# Altium schematic sheet CM4_GPIO.SchDoc
size A3; DocumentNumber: 2; SheetNumber: 2
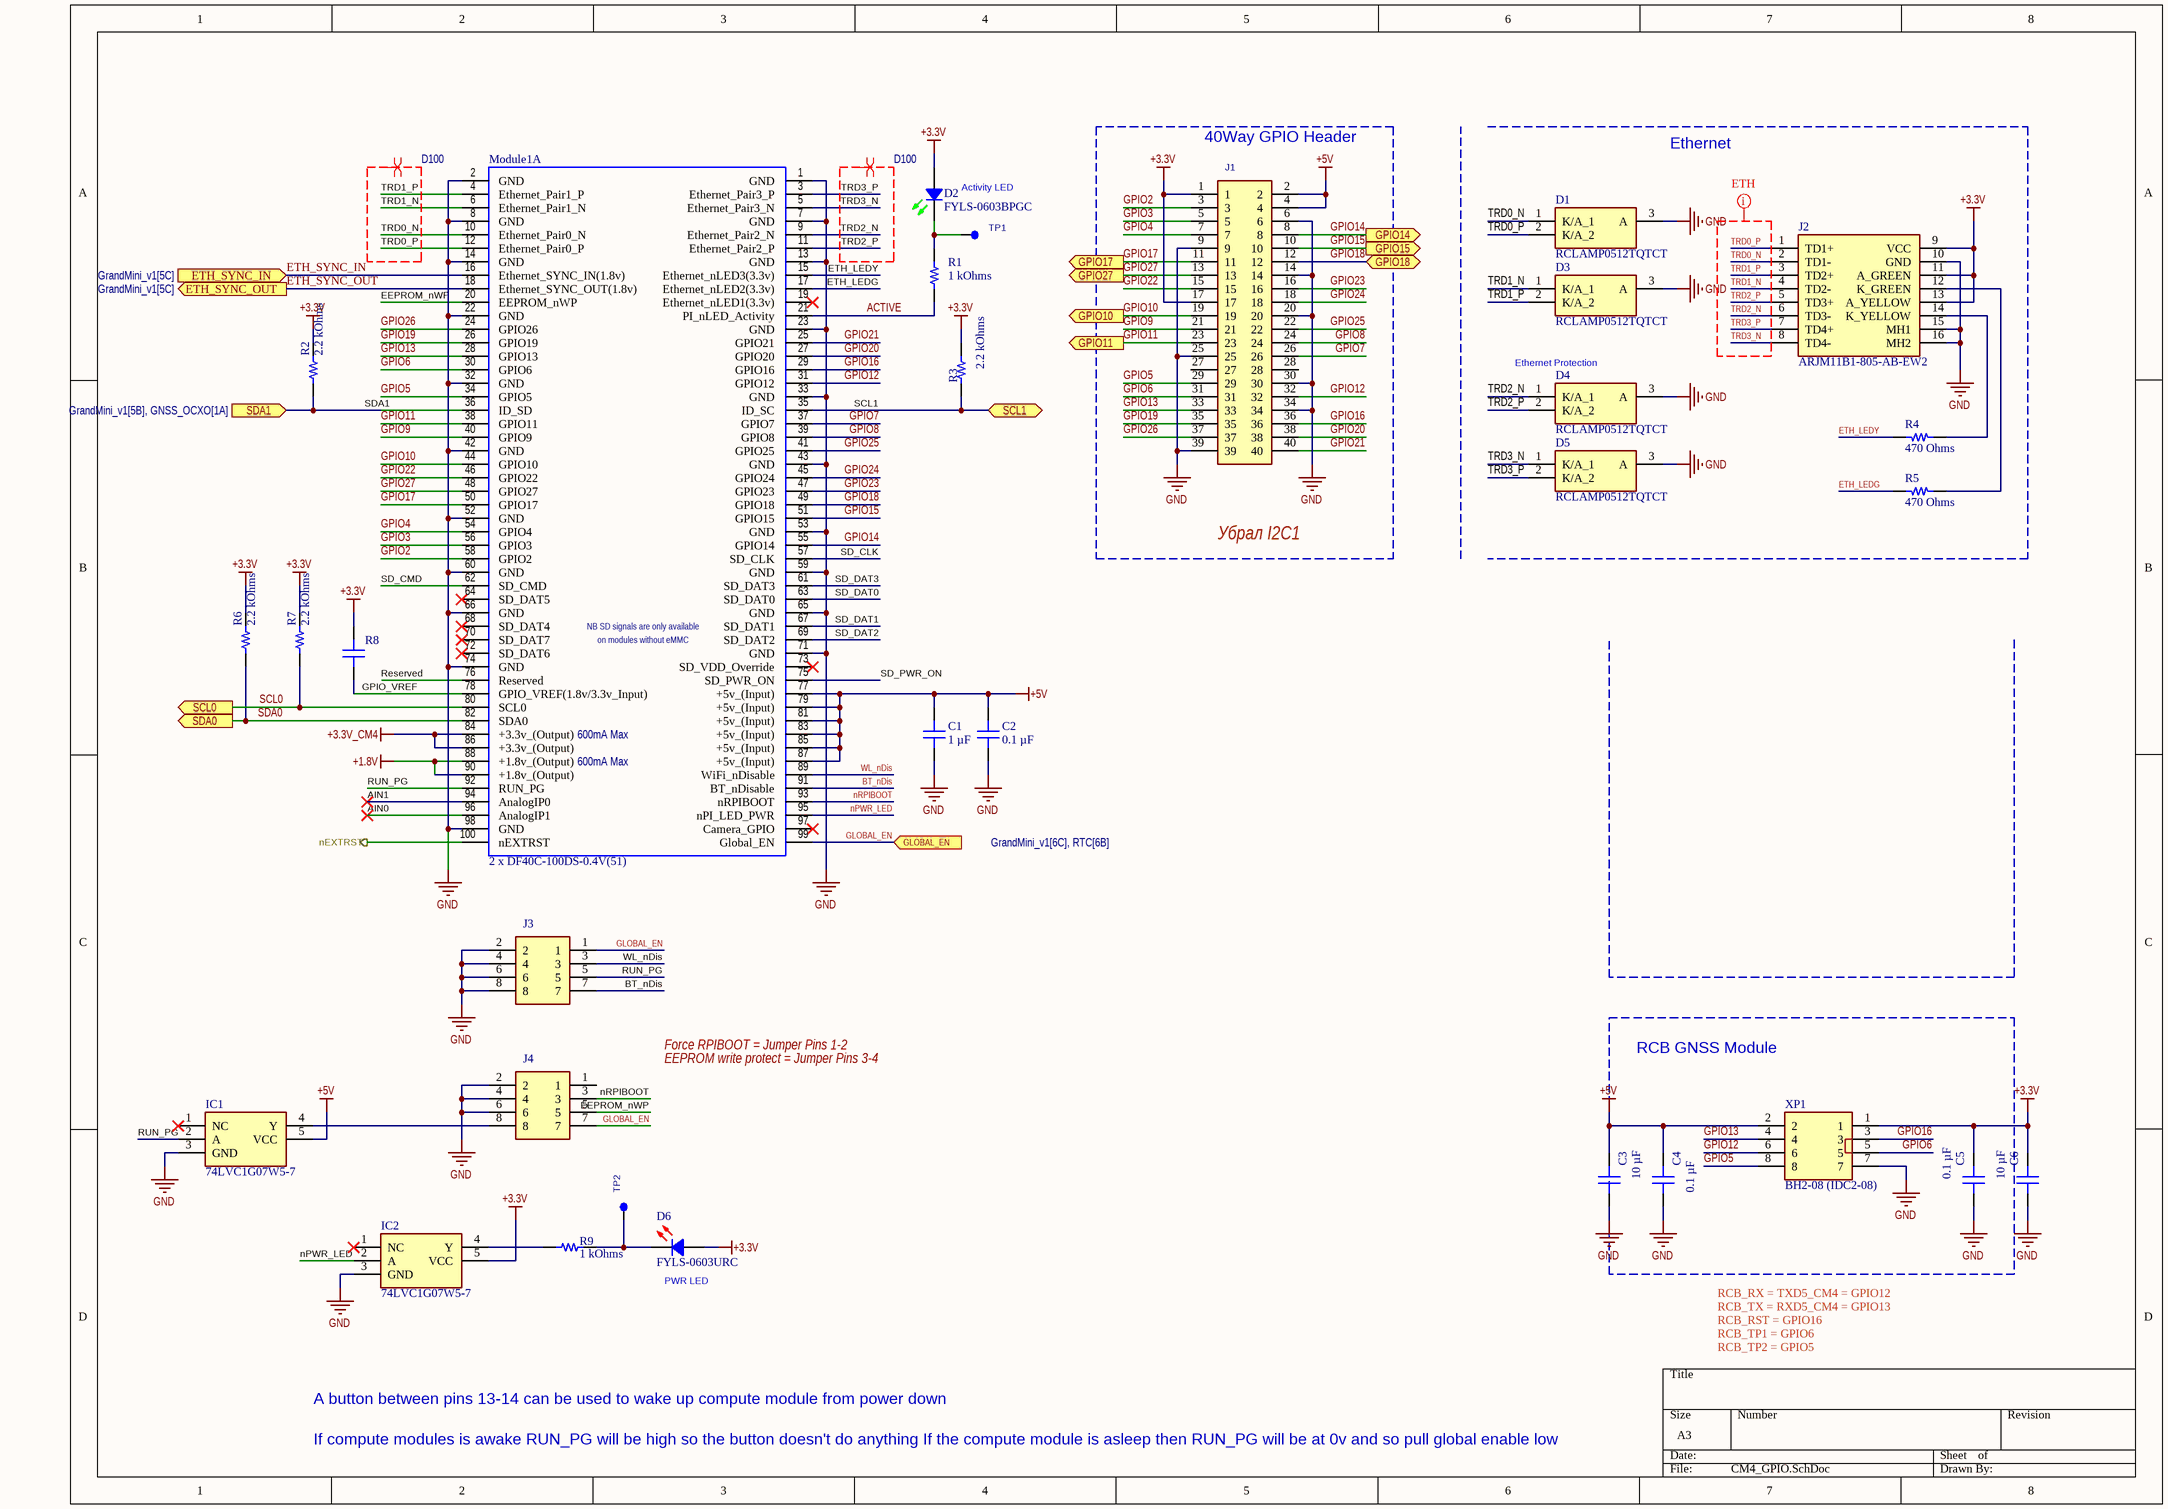
[diagram p0: CM4_GPIO.SchDoc]

## Parts
C1  1 µF  [CAP 0603_1608]
C2  0.1 µF  [CAP 0603_1608]
C3  10 µF  [CAP 0805_2012]
C4  0.1 µF  [CAP 0603_1608]
C5  0.1 µF  [CAP 0603_1608]
C6  10 µF  [CAP 0805_2012]
D1  RCLAMP0512TQTCT  [RCLAMP0512TQTCT]
D2  FYLS-0603BPGC  [LEDC1608X55N_GREEN]
D3  RCLAMP0512TQTCT  [RCLAMP0512TQTCT]
D4  RCLAMP0512TQTCT  [RCLAMP0512TQTCT]
D5  RCLAMP0512TQTCT  [RCLAMP0512TQTCT]
D6  FYLS-0603URC  [LEDC1608X55N_RED]
IC1  74LVC1G07W5-7  [SOT95P285X140-5N]
IC2  74LVC1G07W5-7  [SOT95P285X140-5N]
J1  PBD-40  [PBD-40]  (value not drawn)
J2  ARJM11B1-805-AB-EW2  [ARJM11B1805ABEW2]
J3  PLD-8  [PLD-8]  (value not drawn)
J4  PLD-8  [PLD-8]  (value not drawn)
Module1  2 x DF40C-100DS-0.4V(51)  [RPI_CM4_STACKED]  (part A of 2)
R1  1 kOhms  [YAGEO RES 0603_1608]
R2  2.2 kOhms  [YAGEO RES 0402_1005]
R3  2.2 kOhms  [YAGEO RES 0402_1005]
R4  470 Ohms  [YAGEO RES 0402_1005]
R5  470 Ohms  [YAGEO RES 0402_1005]
R6  2.2 kOhms  [YAGEO RES 0402_1005]
R7  2.2 kOhms  [YAGEO RES 0402_1005]
R8  10 µF  [CAP 0805_2012]  (value not drawn)
R9  1 kOhms  [YAGEO RES 0603_1608]
TP1  PAD_TEST  [PAD_TEST]  (value not drawn)  (no BOM)
TP2  PAD_TEST  [PAD_TEST]  (value not drawn)  (no BOM)
XP1  BH2-08 (IDC2-08)  [BH2-08]

## Blocks framed on the sheet
Убрал I2C1: J1
RCB GNSS Module: C3-C5 XP1

## Ports
ETH_SYNC_IN (in, see GrandMini_v1[5C]), ETH_SYNC_OUT (out, see GrandMini_v1[5C]), GLOBAL_EN (in, see GrandMini_v1[6C], RTC[6B]), GPIO10 (out, see GrandMini_v1[5B], GNSS_OCXO[3A]), GPIO11 (out, see GrandMini_v1[5B], GNSS_OCXO[3A]), GPIO14 (out, see GrandMini_v1[5B], GNSS_OCXO[3A]), GPIO15 (out, see GrandMini_v1[5B], GNSS_OCXO[3A]), GPIO17 (out, see GrandMini_v1[5B], GNSS_OCXO[1B]), GPIO18 (bidir, see GrandMini_v1[5B], GNSS_OCXO[3A]), GPIO27 (out, see GrandMini_v1[5B], GNSS_OCXO[1B]), nEXTRST (out, see GrandMini_v1[6C], USB2-HUB[1B]), SCL0 (out, see GrandMini_v1[6B], RTC[3A]), SCL1 (bidir, see GrandMini_v1[5B], GNSS_OCXO[1A]), SDA0 (out, see GrandMini_v1[6B], RTC[3B]), SDA1 (in, see GrandMini_v1[5B], GNSS_OCXO[1A])

## Nets
+1.8V: Module1.88(+1.8v_(Output)) Module1.90(+1.8v_(Output))
+3.3V: C5.2 C6.2 D2.2(C) D6.2(C) IC2.5(VCC) J1.1 J1.17 J2.9(VCC) J2.11(A_GREEN) J2.13(A_YELLOW) R2.2 R3.2 R6.2 R7.2 R8.2 XP1.1
+3.3V_CM4: Module1.84(+3.3v_(Output)) Module1.86(+3.3v_(Output))
+5V: C1.2 C2.2 C3.2 C4.2 IC1.5(VCC) J1.2 J1.4 Module1.77(+5v_(Input)) Module1.79(+5v_(Input)) Module1.81(+5v_(Input)) Module1.83(+5v_(Input)) Module1.85(+5v_(Input)) Module1.87(+5v_(Input)) XP1.2
GND: C1.1 C2.1 C3.1 C4.1 C5.1 C6.1 D1.3(A) D3.3(A) D4.3(A) D5.3(A) IC1.3(GND) IC2.3(GND) J1.6 J1.9 J1.14 J1.20 J1.25 J1.30 J1.34 J1.39 J2.10(GND) J2.15(MH1) J2.16(MH2) J3.2 J3.4 J3.6 J3.8 J4.2 J4.4 J4.6 Module1.1(GND) Module1.2(GND) Module1.7(GND) Module1.8(GND) Module1.13(GND) Module1.14(GND) Module1.22(GND) Module1.23(GND) Module1.32(GND) Module1.33(GND) Module1.42(GND) Module1.43(GND) Module1.52(GND) Module1.53(GND) Module1.59(GND) Module1.60(GND) Module1.65(GND) Module1.66(GND) Module1.71(GND) Module1.74(GND) Module1.98(GND) XP1.7
ACTIVE: Module1.21(PI_nLED_Activity) R1.1
AIN0: Module1.96(AnalogIP1)
AIN1: Module1.94(AnalogIP0)
BT_nDis: J3.7 Module1.91(BT_nDisable)
EEPROM_nWP: J4.5 Module1.20(EEPROM_nWP)
ETH_LEDG: Module1.17(Ethernet_nLED2(3.3v)) R5.2
ETH_LEDY: Module1.15(Ethernet_nLED3(3.3v)) R4.2
ETH_SYNC_IN: Module1.16(Ethernet_SYNC_IN(1.8v)) ; port ETH_SYNC_IN
ETH_SYNC_OUT: Module1.18(Ethernet_SYNC_OUT(1.8v)) ; port ETH_SYNC_OUT
GLOBAL_EN: J3.1 J4.7 Module1.99(Global_EN) ; port GLOBAL_EN
GPIO2: J1.3 Module1.58(GPIO2)
GPIO3: J1.5 Module1.56(GPIO3)
GPIO4: J1.7 Module1.54(GPIO4)
GPIO5: J1.29 Module1.34(GPIO5) XP1.8
GPIO6: J1.31 Module1.30(GPIO6) XP1.5
GPIO7: J1.26 Module1.37(GPIO7)
GPIO8: J1.24 Module1.39(GPIO8)
GPIO9: J1.21 Module1.40(GPIO9)
GPIO10: J1.19 Module1.44(GPIO10) ; port GPIO10
GPIO11: J1.23 Module1.38(GPIO11) ; port GPIO11
GPIO12: J1.32 Module1.31(GPIO12) XP1.6
GPIO13: J1.33 Module1.28(GPIO13) XP1.4
GPIO14: J1.8 Module1.55(GPIO14) ; port GPIO14
GPIO15: J1.10 Module1.51(GPIO15) ; port GPIO15
GPIO16: J1.36 Module1.29(GPIO16) XP1.3
GPIO17: J1.11 Module1.50(GPIO17) ; port GPIO17
GPIO18: J1.12 Module1.49(GPIO18) ; port GPIO18
GPIO19: J1.35 Module1.26(GPIO19)
GPIO20: J1.38 Module1.27(GPIO20)
GPIO21: J1.40 Module1.25(GPIO21)
GPIO22: J1.15 Module1.46(GPIO22)
GPIO23: J1.16 Module1.47(GPIO23)
GPIO24: J1.18 Module1.45(GPIO24)
GPIO25: J1.22 Module1.41(GPIO25)
GPIO26: J1.37 Module1.24(GPIO26)
GPIO27: J1.13 Module1.48(GPIO27) ; port GPIO27
GPIO_VREF: Module1.78(GPIO_VREF(1.8v/3.3v_Input)) R8.1
nEXTRST: Module1.100(nEXTRST) ; port nEXTRST
nPWR_LED: IC2.2(A) Module1.95(nPI_LED_PWR)
nRPIBOOT: J4.3 Module1.93(nRPIBOOT)
RUN_PG: IC1.2(A) J3.5 Module1.92(RUN_PG)
SCL0: Module1.80(SCL0) R7.1 ; port SCL0
SCL1: Module1.35(ID_SC) R3.1 ; port SCL1
SD_CLK: Module1.57(SD_CLK)
SD_CMD: Module1.62(SD_CMD)
SD_DAT0: Module1.63(SD_DAT0)
SD_DAT1: Module1.67(SD_DAT1)
SD_DAT2: Module1.69(SD_DAT2)
SD_DAT3: Module1.61(SD_DAT3)
SD_PWR_ON: Module1.75(SD_PWR_ON)
SDA0: Module1.82(SDA0) R6.1 ; port SDA0
SDA1: Module1.36(ID_SD) R2.1 ; port SDA1
TRD0_N: D1.1(K/A_1) J2.2(TD1-) Module1.10(Ethernet_Pair0_N)
TRD0_P: D1.2(K/A_2) J2.1(TD1+) Module1.12(Ethernet_Pair0_P)
TRD1_N: D3.1(K/A_1) J2.4(TD2-) Module1.6(Ethernet_Pair1_N)
TRD1_P: D3.2(K/A_2) J2.3(TD2+) Module1.4(Ethernet_Pair1_P)
TRD2_N: D4.1(K/A_1) J2.6(TD3-) Module1.9(Ethernet_Pair2_N)
TRD2_P: D4.2(K/A_2) J2.5(TD3+) Module1.11(Ethernet_Pair2_P)
TRD3_N: D5.1(K/A_1) J2.8(TD4-) Module1.5(Ethernet_Pair3_N)
TRD3_P: D5.2(K/A_2) J2.7(TD4+) Module1.3(Ethernet_Pair3_P)
WL_nDis: J3.3 Module1.89(WiFi_nDisable)
NetD2_1: D2.1(A) R1.2 TP1.1
NetD6_1: D6.1(A) R9.2 TP2.1
NetIC1_4: IC1.4(Y) J4.8
NetIC2_4: IC2.4(Y) R9.1
NetJ2_12: J2.12(K_GREEN) R5.1
NetJ2_14: J2.14(K_YELLOW) R4.1

Not connected (* = marked no-connect by the designer): IC1 1(NC)*; IC2 1(NC)*; J1 27 28; J4 1; Module1 19(Ethernet_nLED1(3.3v))* 64(SD_DAT5)* 68(SD_DAT4)* 70(SD_DAT7)* 72(SD_DAT6)* 73(SD_VDD_Override)* 76(Reserved) 97(Camera_GPIO)*

## Layout directives
differential pair; differential pair class D100: TRD0_N, TRD0_P, TRD1_N, TRD1_P, TRD2_N, TRD2_P, TRD3_N, TRD3_P
net class ETH: TRD0_N, TRD0_P, TRD1_N, TRD1_P, TRD2_N, TRD2_P, TRD3_N, TRD3_P

## Notes on the sheet
- (near J1) 40Way GPIO Header
- Ethernet
- Activity LED
- (near D4) Ethernet
  Protection
- Force RPIBOOT = Jumper Pins 1-2
- EEPROM write protect = Jumper Pins 3-4
- (near D6) PWR LED
- RCB_TX = RXD5_CM4 = GPIO13
- RCB_RX = TXD5_CM4 = GPIO12
- RCB_RST = GPIO16
- RCB_TP1 = GPIO6
- RCB_TP2 = GPIO5
- A button between pins 13-14 can be used to wake up compute module from power down
- If compute modules is awake RUN_PG will be high so the button doesn't do anything
  If the compute module is asleep then RUN_PG will be at 0v and so pull global enable low
- Labels drawn without touching a wire or pin: Reserved
- 1
- 2
- 3
- 4
- 5
- 6
- A
- B
- C
- www.raspberrypi.com <http://www.raspberrypi.com>
- D
- Title: Compute Module 4 IO Board - GPIO - Ethernet
- File: CM4_GPIO.kicad_sch
- Sheet: /
- © 2020-2022 Raspberry Pi Ltd (formerly Raspberry Pi (Trading) Ltd.)
- KiCad E.D.A.  kicad (5.1.4)-1
- Size: A4
- Date:
- Rev: 1
- Id: 1/1
- (in symbol RPi_CM4_1, part A) NB SD signals are only available; on modules without eMMC; 600mA Max

## Library data of the parts
C1 = CC0603KRX7R9BB105: CAP CER 1UF 50V X7R 0603; manufacturer: Yageo; Tolerance: ±10%; Part Number: CC0603KRX7R9BB105; Value: 1 µF; Applications: General Purpose; Capacitance: 1 µF; componentlink1description: Datasheet; componentlink1url: https://www.yageo.com/upload/media/product/productsearch/datasheet/mlcc/UPY-GPHC_X7R_6.3V-to-50V_20.pdf; componentlink2description: DigiKey Link; componentlink2url: https://www.digikey.com/en/products/detail/yageo/CC0603KRX7R9BB105/5883796; Device Package: 0603 (1608 Metric); lastupdated: 09.02.2024 20:09:49; Lifecycle Status: Active; Minimum Order: 1; Mounting Type: Surface Mount, MLCC; Operating Temperature: -55°C ~ 125°C; Package / Case: 0603 (1608 Metric); packaging: TapeAndReel; partid: 45844; Part Status: Active; price: 0.09; series: CC; Size / Dimension: 0.063" L x 0.031" W (1.60mm x 0.80mm); Supplier 1: DigiKey; Supplier Part Number 1: 311-2082-1-ND; Temperature Coefficient: X7R; Thickness (Max): 0.035" (0.90mm); Voltage - Rated: 50V
C2 C4 C5 = CC0603KRX7R9BB104: CAP CER 0.1UF 50V X7R 0603; manufacturer: Yageo; Tolerance: ±10%; Part Number: CC0603KRX7R9BB104; Value: 0.1 µF; Applications: General Purpose; Capacitance: 0.1 µF; componentlink1description: Datasheet; componentlink1url: https://www.yageo.com/upload/media/product/productsearch/datasheet/mlcc/UPY-GPHC_X7R_6.3V-to-50V_18.pdf; componentlink2description: DigiKey Link; componentlink2url: https://www.digikey.com/en/products/detail/yageo/CC0603KRX7R9BB104/2103082; Device Package: 0603 (1608 Metric); lastupdated: 09.02.2024 20:10:21; Lifecycle Status: Active; Minimum Order: 1; Mounting Type: Surface Mount, MLCC; Operating Temperature: -55°C ~ 125°C; Package / Case: 0603 (1608 Metric); packaging: TapeAndReel; partid: 9506; Part Status: Active; price: 0.01; series: CC; Size / Dimension: 0.063" L x 0.031" W (1.60mm x 0.80mm); Supplier 1: DigiKey; Supplier Part Number 1: 311-1344-1-ND; Temperature Coefficient: X7R; Thickness (Max): 0.035" (0.90mm); Voltage - Rated: 50V
C3 C6 R8 = CC0805KKX5R8BB106: CAP CER 10UF 25V X5R 0805; manufacturer: Yageo; Tolerance: ±10%; Value: 10 µF; Part Number: CC0805KKX5R8BB106; Applications: General Purpose; Capacitance: 10 µF; componentlink1description: Datasheet; componentlink1url: https://www.yageo.com/upload/media/product/productsearch/datasheet/mlcc/UPY-GPHC_X5R_4V-to-50V_25.pdf; componentlink2description: DigiKey Link; componentlink2url: https://www.digikey.com/en/products/detail/yageo/CC0805KKX5R8BB106/5195275; Device Package: 0805 (2012 Metric); lastupdated: 09.02.2024 20:15:28; Lifecycle Status: Active; Minimum Order: 1; Mounting Type: Surface Mount, MLCC; Operating Temperature: -55°C ~ 85°C; Package / Case: 0805 (2012 Metric); packaging: TapeAndReel; partid: 16151; Part Status: Active; price: 0.06; series: CC; Size / Dimension: 0.079" L x 0.049" W (2.00mm x 1.25mm); Supplier 1: DigiKey; Supplier Part Number 1: 311-1869-1-ND; Temperature Coefficient: X5R; Thickness (Max): 0.057" (1.45mm); Voltage - Rated: 25V
D1 D3-D5 = RCLAMP0512TQTCT: Diode; Manufacturer_Name: SEMTECH; Datasheet Link: https://media.digikey.com/pdf/Data%20Sheets/Semtech%20PDFs/RCLAMP0512TQ_Rev6_12-17-15.pdf; Height: 0.45mm; Manufacturer_Part_Number: RCLAMP0512TQTCT; Mouser Part Number: 947-RCLAMP0512TQTCT; Mouser Price/Stock: https://www.mouser.co.uk/ProductDetail/Semtech/RCLAMP0512TQTCT?qs=rBWM4%252BvDhIfq7vcNOg1BvQ%3D%3D; Arrow Part Number: RCLAMP0512TQTCT; Arrow Price/Stock: https://www.arrow.com/en/products/rclamp0512tqtct/semtech?utm_currency=USD&region=europe
D2 = FYLS-0603BPGC: LED, 0603, GREEN; Manufacturer_Name: FORYARD; Datasheet Link: https://v4.cecdn.yun300.cn/100001_2003185297/7%20FYLS-0603BXXXC-D.pdf; Height: 0.6mm; Manufacturer_Part_Number: FYLS-0603BPGC
D6 = FYLS-0603URC: LED, 0603, RED; Manufacturer_Name: FORYARD; Datasheet Link: https://v4.cecdn.yun300.cn/100001_2003185297/7%20FYLS-0603BXXXC-D.pdf; Height: 0.6mm; Manufacturer_Part_Number: FYLS-0603URC
IC1 IC2 = 74LVC1G07W5-7: Integrated Circuit; Manufacturer_Name: Diodes Incorporated; Datasheet Link: https://www.diodes.com//assets/Datasheets/74LVC1G07.pdf; Height: 1.4mm; Manufacturer_Part_Number: 74LVC1G07W5-7; Mouser Part Number: 621-74LVC1G07W5-7; Mouser Price/Stock: https://www.mouser.co.uk/ProductDetail/Diodes-Incorporated/74LVC1G07W5-7?qs=abZ1nkZpTuMhe1bWQEjvtw%3D%3D; Arrow Part Number: 74LVC1G07W5-7; Arrow Price/Stock: https://www.arrow.com/en/products/74lvc1g07w5-7/diodes-incorporated?utm_currency=USD&region=nac
J1 = PBD-40: Connector; Manufacturer: Connfly; Part Number1: DS-1023-2x20; System: Connector; Part Number: PBD-40
J2 = ARJM11B1-805-AB-EW2: Connector; Manufacturer_Name: ABRACON; Datasheet Link: https://abracon.com/Magnetics/ARJM11.pdf; Height: 13.75mm; Manufacturer_Part_Number: ARJM11B1-805-AB-EW2; Mouser Part Number: 815-RJM11B1805ABEW2; Mouser Price/Stock: https://www.mouser.co.uk/ProductDetail/ABRACON/ARJM11B1-805-AB-EW2?qs=YCa%2FAAYMW02bp%252BSCNzjdNA%3D%3D; Arrow Part Number: ARJM11B1-805-AB-EW2; Arrow Price/Stock: https://www.arrow.com/en/products/arjm11b1-805-ab-ew2/abracon?region=nac
J3 J4 = PLD-8_1: Connector; Manufacturer_Name: JST (JAPAN SOLDERLESS TERMINALS); Manufacturer_Part_Number: S4B-PH-SM4-TB(LF)(SN); Datasheet Link: http://uk.rs-online.com/web/p/products/6881366; Arrow Part Number: S4B-PH-SM4-TB(LF)(SN); Arrow Price/Stock: https://www.arrow.com/en/products/s4b-ph-sm4-tb-lf-sn/jst-manufacturing; System: Connector
Module1 = RPi_CM4_1: Rapsberry PI Compute Module 4 +
R1 R9 = RC0603FR-071KL: RES 1K OHM 1% 1/10W 0603; Manufacturer: Yageo; Power (Watts): 0.1W, 1/10W; Temperature Coefficient: ±100ppm/°C; Value: 1 kOhms; Part Number: RC0603FR-071KL; ComponentLink1Description: Datasheet; ComponentLink1URL: https://www.yageo.com/upload/media/product/productsearch/datasheet/rchip/PYu-RC_Group_51_RoHS_L_10.pdf; ComponentLink2Description: DigiKey Link; ComponentLink2URL: https://www.digikey.com/en/products/detail/yageo/RC0603FR-071KL/726843; Composition: Thick Film; Device Package: 0603 (1608 Metric); Features: Moisture Resistant; Height - Seated (Max): 0.022" (0.55mm); LastUpdated: 25.07.2024 9:19:19; Lifecycle Status: Active; Minimum Order: 1; Number of Terminations: 2; Operating Temperature: -55°C ~ 155°C; Package / Case: 0603 (1608 Metric); Packaging: CutTape; PartId: 22600; Part Status: Active; Price: 0.01; Resistance: 1 kOhms; Series: RC_L; Size / Dimension: 0.063" L x 0.031" W (1.60mm x 0.80mm); Supplier 1: DigiKey; Supplier Part Number 1: 311-1.00KHRCT-ND; Supplier Device Package: 0603; Tolerance: ±1%
R2 R3 R6 R7 = RC0402FR-072K2L: RES 2.2K OHM 1% 1/16W 0402; Manufacturer: Yageo; Power (Watts): 0.063W, 1/16W; Temperature Coefficient: ±100ppm/°C; Part Number: RC0402FR-072K2L; Value: 2.2 kOhms; ComponentLink1Description: Datasheet; ComponentLink1URL: https://www.yageo.com/upload/media/product/productsearch/datasheet/rchip/PYu-RC_Group_51_RoHS_L_10.pdf; ComponentLink2Description: DigiKey Link; ComponentLink2URL: https://www.digikey.com/en/products/detail/yageo/RC0402FR-072K2L/726553; Composition: Thick Film; Device Package: 0402 (1005 Metric); Features: Moisture Resistant; Height - Seated (Max): 0.016" (0.40mm); LastUpdated: 25.07.2024 9:18:11; Lifecycle Status: Active; Minimum Order: 1; Number of Terminations: 2; Operating Temperature: -55°C ~ 155°C; Package / Case: 0402 (1005 Metric); Packaging: CutTape; PartId: 17607; Part Status: Active; Price: 0.01; Resistance: 2.2 kOhms; Series: RC_L; Size / Dimension: 0.039" L x 0.020" W (1.00mm x 0.50mm); Supplier 1: DigiKey; Supplier Part Number 1: 311-2.20KLRCT-ND; Supplier Device Package: 0402; Tolerance: ±1%
R4 R5 = RC0402FR-07470RL: RES 470 OHM 1% 1/16W 0402; Manufacturer: Yageo; Power (Watts): 0.063W, 1/16W; Temperature Coefficient: ±100ppm/°C; Packaging: CutTape; Composition: Thick Film; Tolerance: ±1%; Resistance: 470 Ohms; Value: 470 Ohms; Series: RC_L; Number of Terminations: 2; ComponentLink1URL: https://www.yageo.com/upload/media/product/productsearch/datasheet/rchip/PYu-RC_Group_51_RoHS_L_10.pdf; ComponentLink1Description: Datasheet; ComponentLink2URL: https://www.digikey.com/en/products/detail/yageo/RC0402FR-07470RL/726619; ComponentLink2Description: DigiKey Link; Part Number: RC0402FR-07470RL; Device Package: 0402 (1005 Metric); Features: Moisture Resistant; Height - Seated (Max): 0.016" (0.40mm); LastUpdated: 25.07.2024 9:18:11; Lifecycle Status: Active; Minimum Order: 1; Operating Temperature: -55°C ~ 155°C; Package / Case: 0402 (1005 Metric); PartId: 17923; Part Status: Active; Price: 0.01; Size / Dimension: 0.039" L x 0.020" W (1.00mm x 0.50mm); Supplier 1: DigiKey; Supplier Part Number 1: 311-470LRCT-ND; Supplier Device Package: 0402
TP1 TP2 = PAD_TEST: Test Point; Manufacturer: {Manufacturer}; Reseller3: {Reseller3}; Reseller1: {Reseller1}; Tempcoeff: {Tempcoeff}; Reseller2: {Reseller2}; Tolerance: {Tolerance}; Value: .NetName; PowerVoltage: {PowerVoltage}; CatalogueCode: {CatalogueCode}; Case: {Case}
XP1 = BH2-08: Connector; Manufacturer_Name: Connfly; Manufacturer_Part_Number: DS1014-08; Manufacturer_Part_Number_1: IDC2-08MS; Datasheet Link: https://static.chipdip.ru/lib/463/DOC002463525.pdf; System: Connector